# EasyEDA schematic LEAP Transmission Controller V1_2020-07-04_18-08-02.json
TITLE: 8 Bit Serial to Parallel Converter; REV: 1.0; Date: 2020-07-02; Sheet: 1/1; Company: LEAP Org.
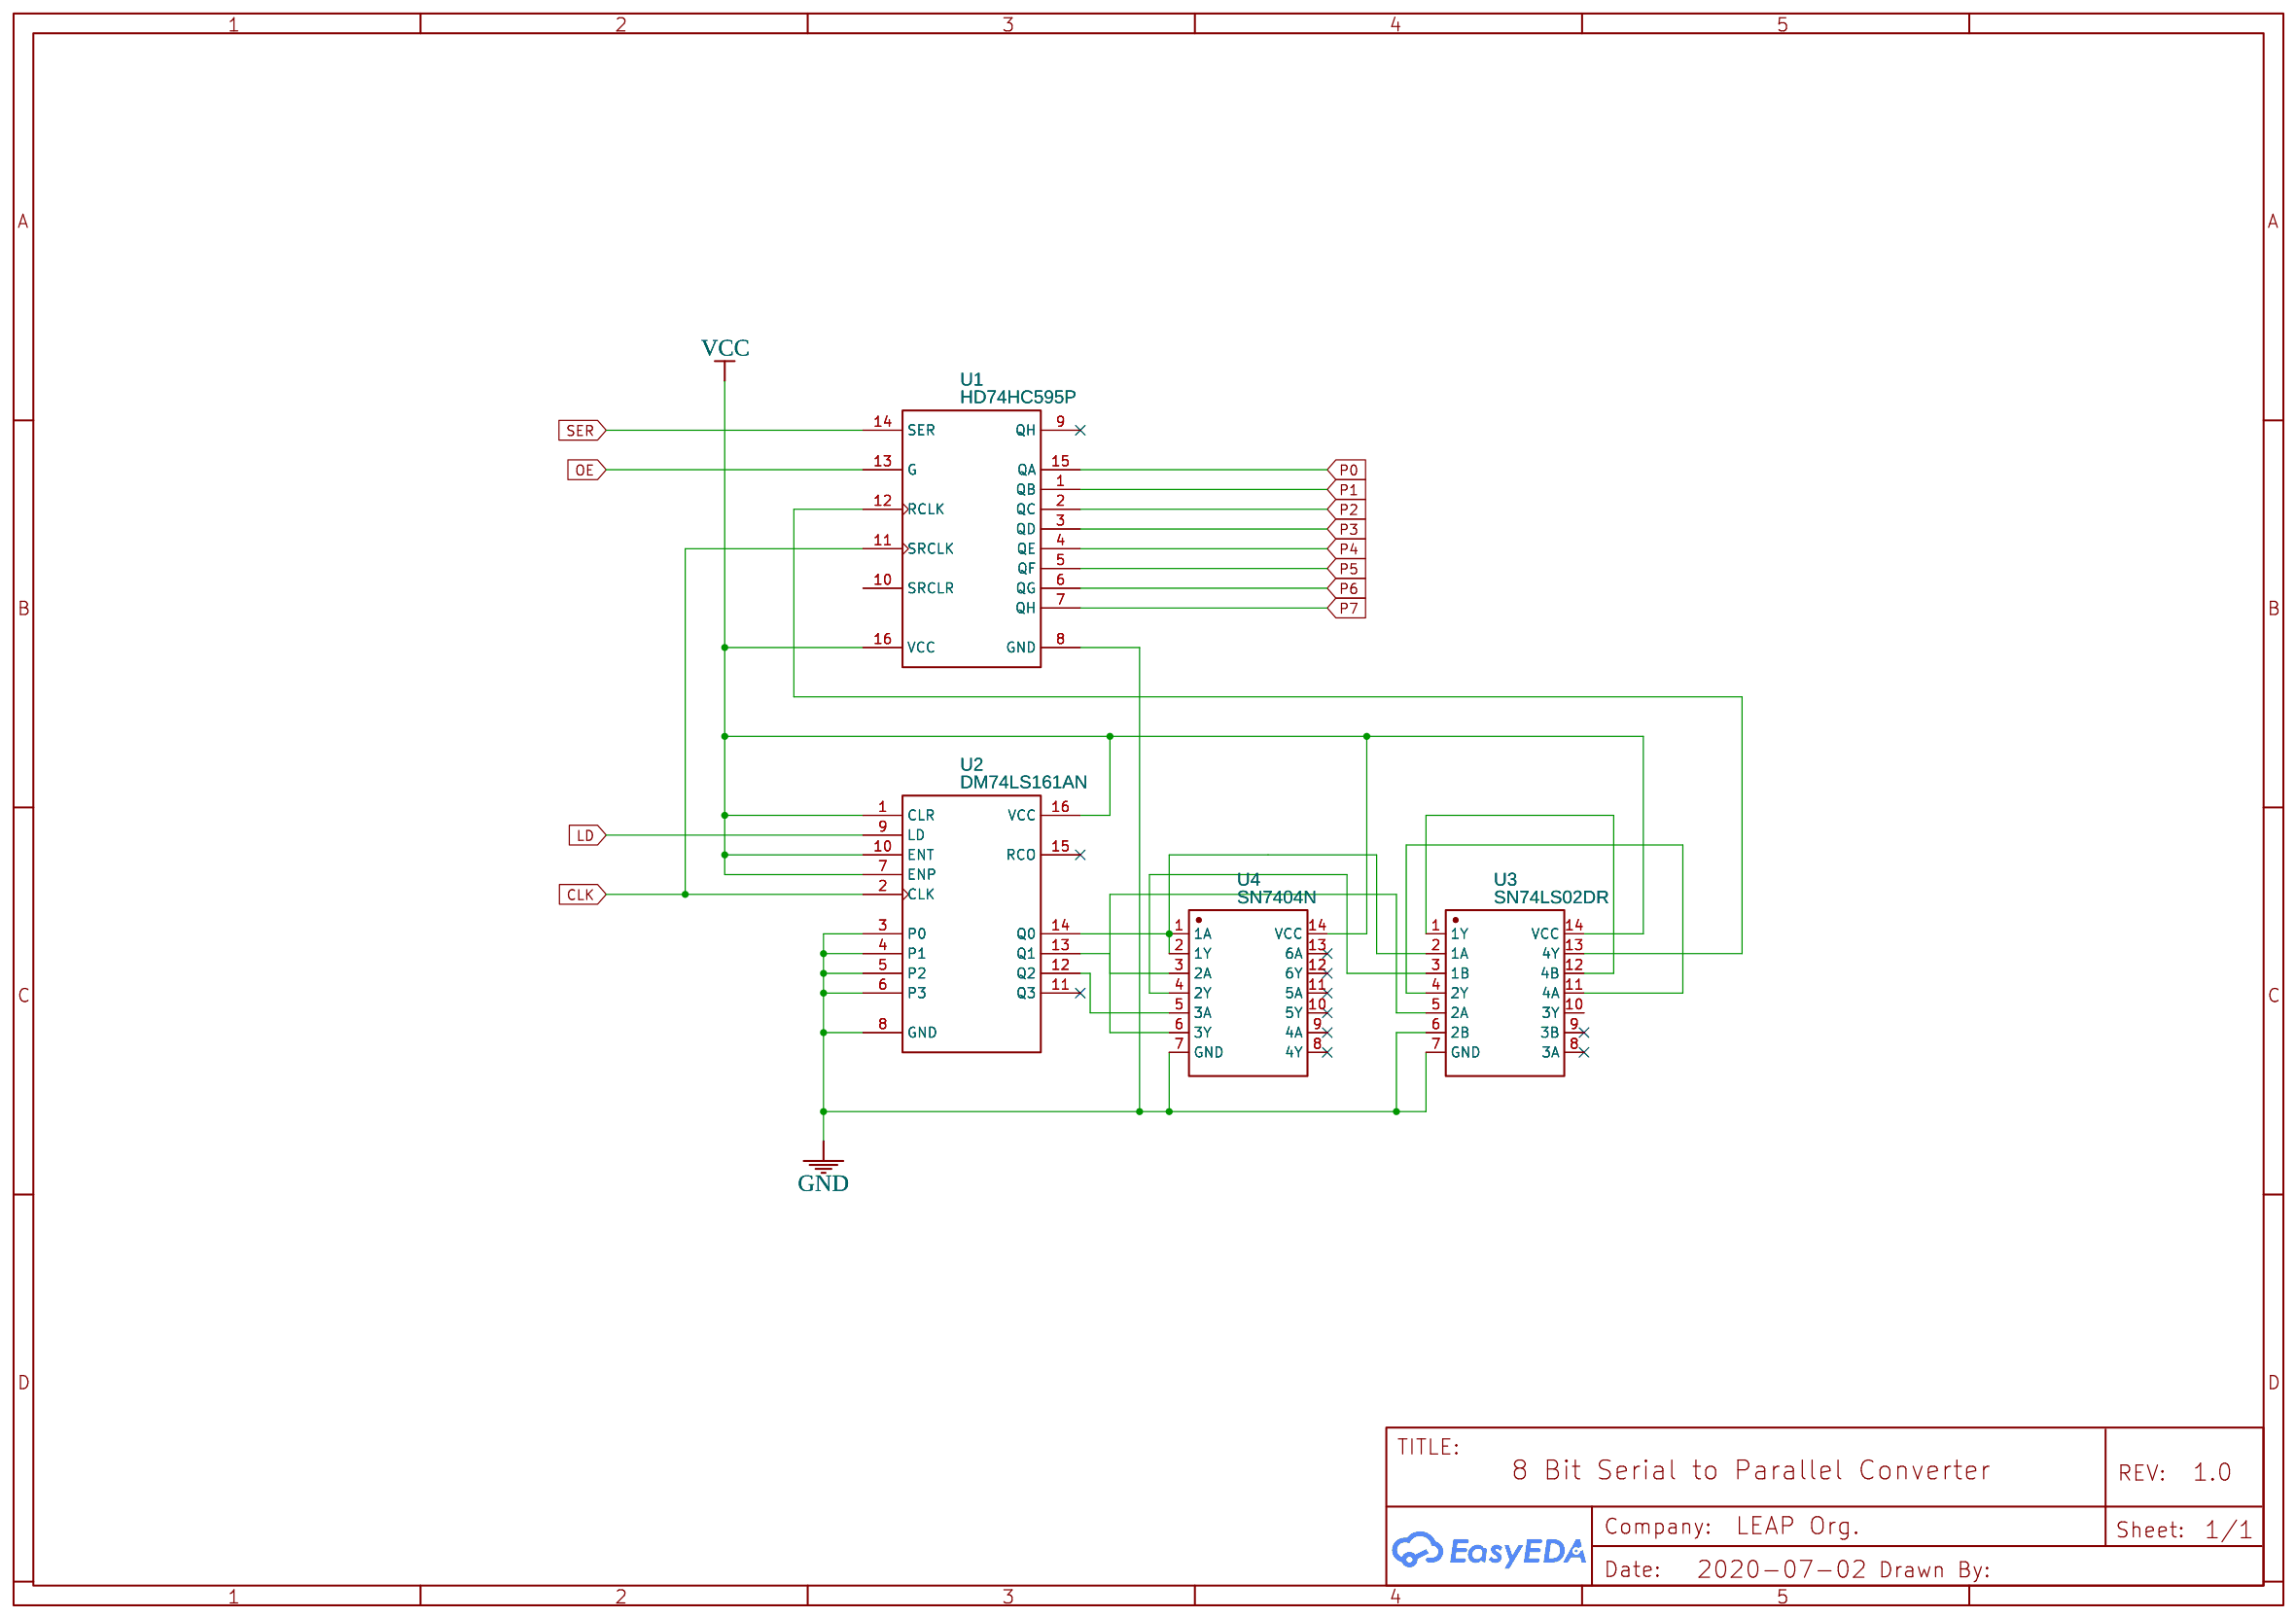
[diagram p0: schematic sheet]

## Parts
U1  HD74HC595P  [DIP16]
U2  DM74LS161AN  [DIP16]
U3  SN74LS02DR  [SOIC-14_L8.7-W3.9-P1.27-LS6.0-BL]
U4  SN7404N  [DIP14]

## Library data of the parts
U1 = HD74HC595P: 8-bit Shift Register  Latch with 3-State Outputs
U2 = DM74LS161AN: Synchronous 4-Bit Binary Counter
U3 = SN74LS02DR: Supplier: LCSC; Manufacturer: TI; image: //image.lceda.cn/szlcsc/C6794.jpg; Supplier Part: C6794; LCSC Assembly: Yes; SMT Type: Extend
U4 = SN7404N

## Nets
GND: U1.8(GND) U2.3(P0) U2.4(P1) U2.5(P2) U2.6(P3) U2.8(GND) U3.6(2B) U3.7(GND) U4.7(GND)
VCC: U1.16(VCC) U2.1(CLR) U2.7(ENP) U2.10(ENT) U2.16(VCC) U3.14(VCC) U4.14(VCC)
CLK: U1.11(SRCLK) U2.2(CLK)
LD: U2.9(LD)
OE: U1.13(G)
P0: U1.15(QA)
P1: U1.1(QB)
P2: U1.2(QC)
P3: U1.3(QD)
P4: U1.4(QE)
P5: U1.5(QF)
P6: U1.6(QG)
P7: U1.7(QH)
SER: U1.14(SER)
Net-(U1-12): U1.12(RCLK) U3.13(4Y)
Net-(U2-12): U2.12(Q2) U4.5(3A)
Net-(U2-13): U2.13(Q1) U4.3(2A)
Net-(U2-14): U2.14(Q0) U3.2(1A) U4.1(1A) U4.2(1Y)
Net-(U3-1): U3.1(1Y) U3.12(4B)
Net-(U3-3): U3.3(1B) U4.4(2Y)
Net-(U3-4): U3.4(2Y) U3.11(4A)
Net-(U3-5): U3.5(2A) U4.6(3Y)

Not connected (* = marked no-connect by the designer): U1 9(QH)* 10(SRCLR); U2 11(Q3)* 15(RCO)*; U3 8(3A)* 9(3B)* 10(3Y); U4 8(4Y)* 9(4A)* 10(5Y)* 11(5A)* 12(6Y)* 13(6A)*
